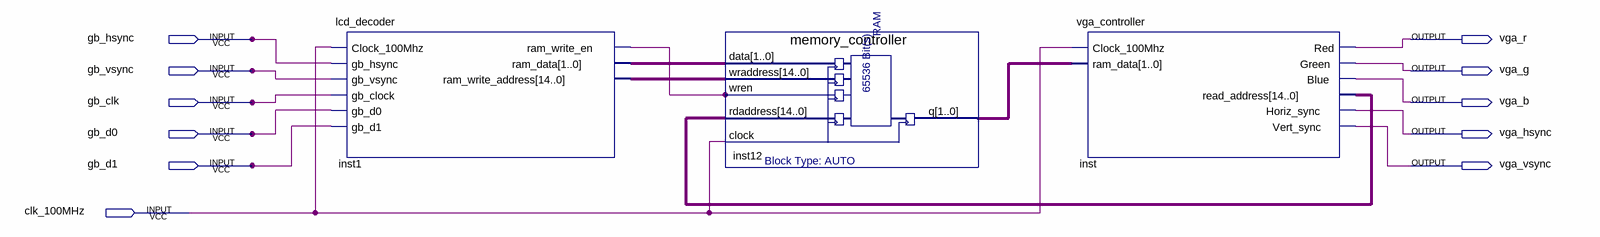
[diagram p0: schematic sheet]
// Quartus schematic gameboy_lcd_to_vga.bdf as structural Verilog: 3 symbols, 11 pins
module gameboy_lcd_to_vga (
  input  gb_hsync,
  input  gb_vsync,
  input  gb_clk,
  input  gb_d0,
  input  gb_d1,
  input  clk_100MHz,
  output vga_r,
  output vga_g,
  output vga_b,
  output vga_hsync,
  output vga_vsync
);

  wire inst1_ram_write_en;
  wire [1:0] inst1_ram_data, inst12_q;
  wire [14:0] inst1_ram_write_address, inst_read_address;

  lcd_decoder inst1 (
    .gb_hsync(gb_hsync), .gb_vsync(gb_vsync), .gb_clock(gb_clk), .gb_d0(gb_d0), .gb_d1(gb_d1),
    .Clock_100Mhz(clk_100MHz), .ram_write_en(inst1_ram_write_en), .ram_data(inst1_ram_data),
    .ram_write_address(inst1_ram_write_address));
  memory_controller inst12 (
    .data(inst1_ram_data), .wraddress(inst1_ram_write_address), .wren(inst1_ram_write_en),
    .rdaddress(inst_read_address), .clock(clk_100MHz), .q(inst12_q));
  vga_controller inst (
    .ram_data(inst12_q), .Clock_100Mhz(clk_100MHz), .Red(vga_r), .Green(vga_g), .Blue(vga_b),
    .read_address(inst_read_address), .Horiz_sync(vga_hsync), .Vert_sync(vga_vsync));
endmodule
